# EAGLE schematic DAC (EAGLE 6.4)
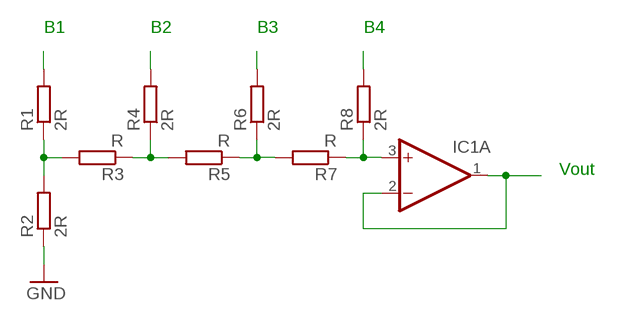
[diagram p0: schematic, sheet 1]

## Parts
IC1  QUAD_OPAMPP  [DIL14]
R1  2R  R-EU_0309/12  [0309/12]
R2  2R  R-EU_0309/12  [0309/12]
R3  R  R-EU_0309/12  [0309/12]
R4  2R  R-EU_0309/12  [0309/12]
R5  R  R-EU_0309/12  [0309/12]
R6  2R  R-EU_0309/12  [0309/12]
R7  R  R-EU_0309/12  [0309/12]
R8  2R  R-EU_0309/12  [0309/12]

## Nets
GND: R2.1
N$1: R1.1 R2.2 R3.2
N$2: R1.2
N$3: R3.1 R4.1 R5.2
N$4: R5.1 R6.1 R7.2
N$5: IC1.3(A:+IN) R7.1 R8.1
N$6: R4.2
N$7: R6.2
N$8: R8.2
N$9: IC1.1(A:OUT) IC1.2(A:-IN)
Unconnected: IC1.5(B:+IN) IC1.6(B:-IN) IC1.7(B:OUT) IC1.8(C:OUT) IC1.9(C:-IN) IC1.10(C:+IN) IC1.12(D:+IN) IC1.13(D:-IN) IC1.14(D:OUT)

## Notes on the sheet
- B1 | B2 | B3 | B4
- Vout

## Power pins joined to a net without a drawn wire
V+: IC1.4(P:V+)
V-: IC1.11(P:V-)

## Library data of the parts
IC1 = adafruit:QUAD_OPAMP: OP AMP Standard quad package
R1-R8 = rcl:R-EU_: RESISTOR, European symbol